# EAGLE design NU-Smarticles (EAGLE 9.3.0)

## Sheet 1 of 2
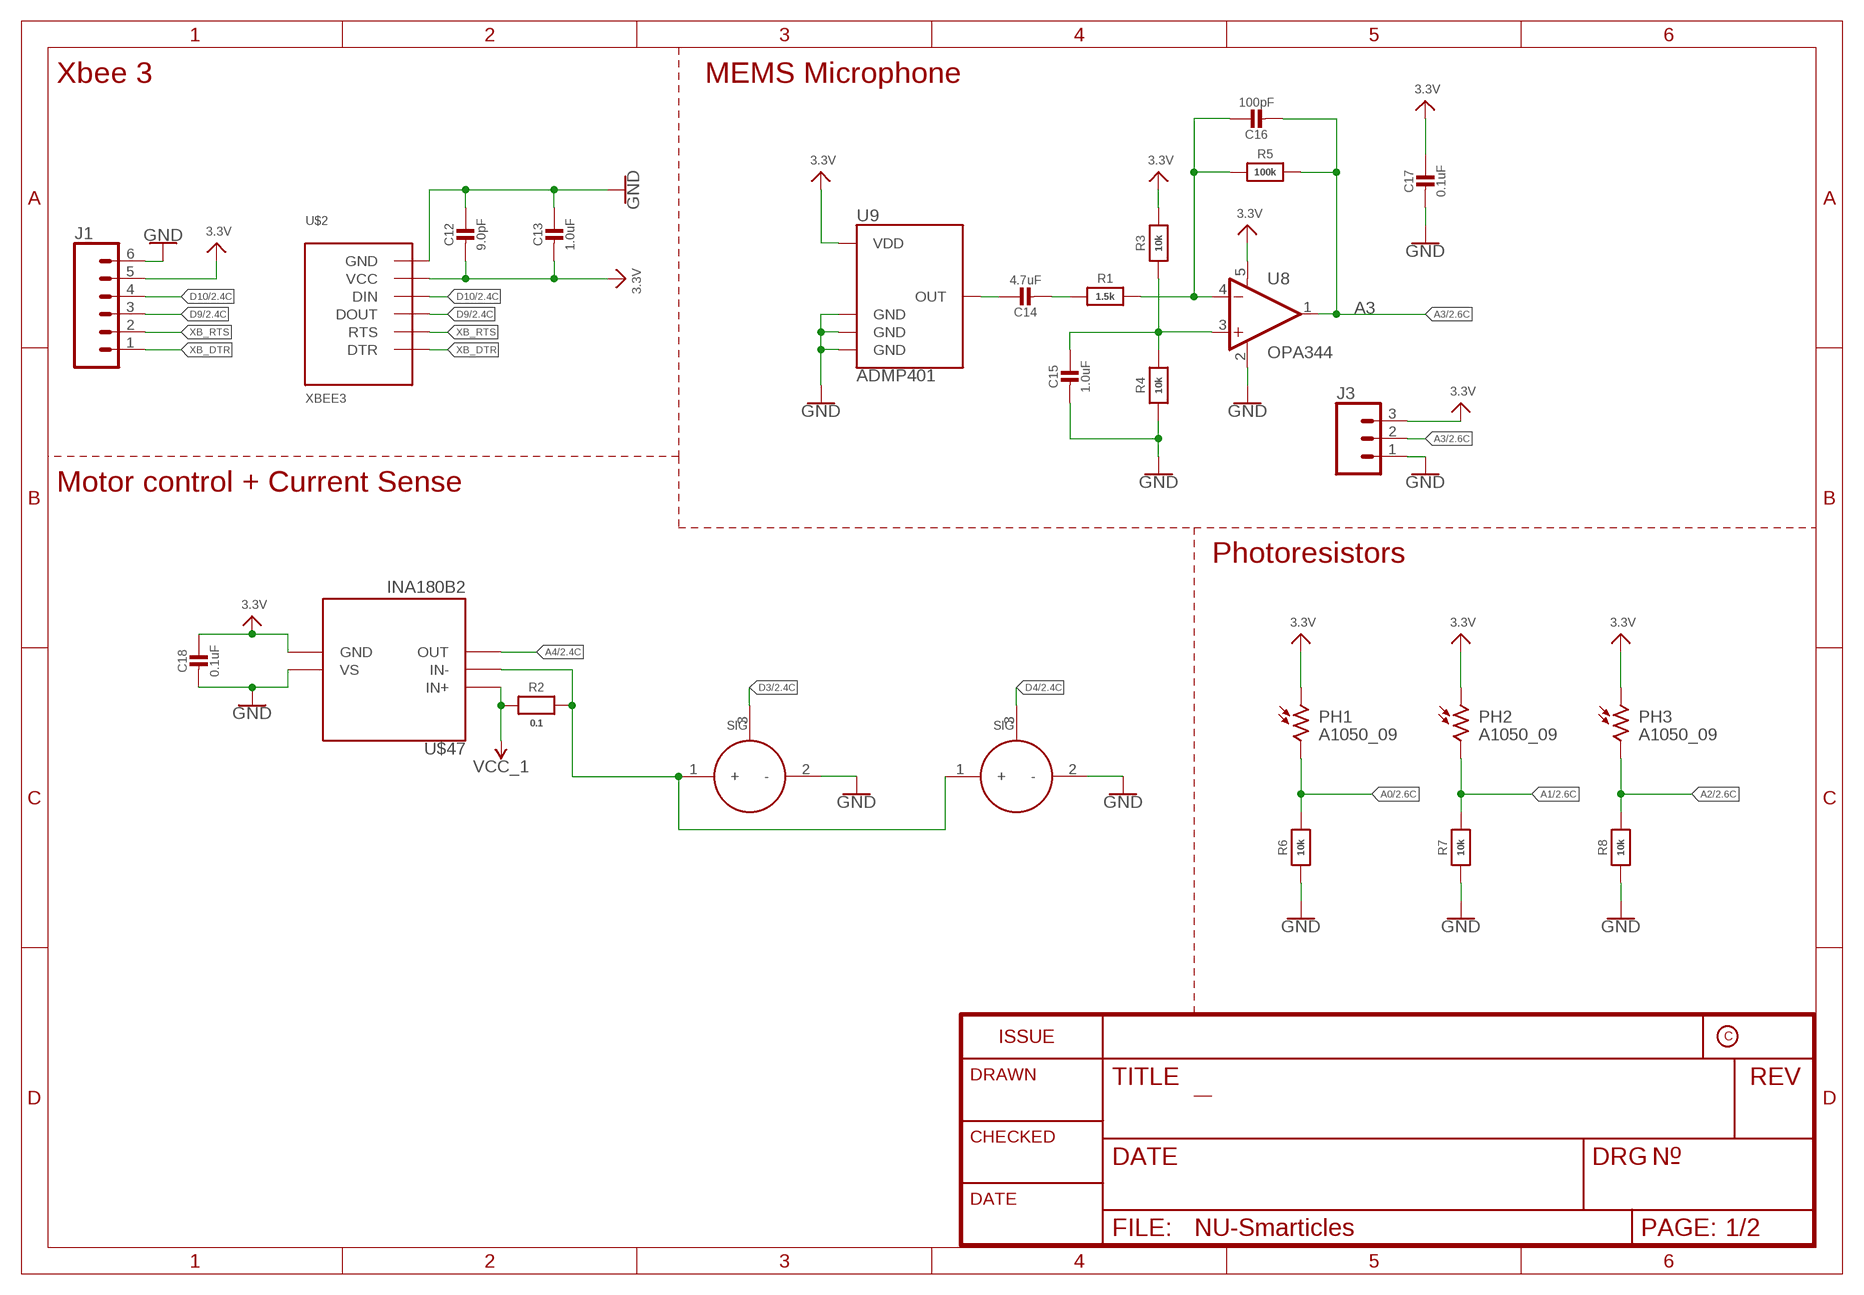
[diagram p0: schematic, sheet 1]

### Parts
C12  9.0pF  CAP_CERAMIC_0402MP  [_0402MP]
C13  1.0uF  CAP_CERAMIC_0402MP  [_0402MP]
C14  4.7uF  CAP_CERAMIC_0402MP  [_0402MP]
C15  1.0uF  CAP_CERAMIC_0402MP  [_0402MP]
C16  100pF  CAP_CERAMIC_0402MP  [_0402MP]
C17  0.1uF  CAP_CERAMIC_0402MP  [_0402MP]
C18  0.1uF  CAP_CERAMIC_0402MP  [_0402MP]
J1  CONN_06NO_SILK_FEMALE_PTH  [1X06_NO_SILK]
J3  CONN_03  [1X03]
PH1  A1050_09  [T0-46-A10XX]
PH2  A1050_09  [T0-46-A10XX]
PH3  A1050_09  [T0-46-A10XX]
R1  1.5k  RESISTOR_0402MP  [_0402MP]
R2  0.1  RESISTOR_0603MP  [_0603MP]
R3  10k  RESISTOR_0402MP  [_0402MP]
R4  10k  RESISTOR_0402MP  [_0402MP]
R5  100k  RESISTOR_0402MP  [_0402MP]
R6  10k  RESISTOR_0402MP  [_0402MP]
R7  10k  RESISTOR_0402MP  [_0402MP]
R8  10k  RESISTOR_0402MP  [_0402MP]
U8  OPA344  [SOT23-5]
U9  ADMP401  [ADMP401]
U$1  SERVO  [1X03_SERVO]
U$2  XBEE3  [XBEE3_MICRO]
U$46  SERVO  [1X03_SERVO]
U$47  INA180B2  [SOT23-5]

### Nets
3.3V: C12.2 C13.2 C17.1 C18.1 J1.5 J3.3 PH1.1 PH2.1 PH3.1 R3.2 U8.5(V+) U9.5(VDD) U$2.VCC U$47.2(GND) ; also sheet 2
A0: PH1.2 R6.2 ; also sheet 2
A1: PH2.2 R7.2 ; also sheet 2
A2: PH3.2 R8.2 ; also sheet 2
A3: C16.2 J3.2 R5.2 U8.1(OUT) ; also sheet 2
A4: U$47.4(OUT) ; also sheet 2
D3: U$1.3(SIG) ; also sheet 2
D4: U$46.3(SIG) ; also sheet 2
D9: J1.3 U$2.DOUT/DIO13(DOUT) ; also sheet 2
D10: J1.4 U$2.DIN/CONFIG/DIO14(DIN) ; also sheet 2
GND: C12.1 C13.1 C15.2 C17.2 C18.2 J1.6 J3.1 R4.1 R6.1 R7.1 R8.1 U8.2(V-) U9.2(GND) U9.4(GND) U9.6(GND) U$1.2(-) U$2.GND1(GND) U$46.2(-) U$47.5(VS) ; also sheet 2
N$1: R2.2 U$1.1(+) U$46.1(+) U$47.3(IN-)
N$16: C14.1 U9.1(OUT)
N$17: C16.1 R1.2 R5.1 U8.4(-IN)
N$29: C14.2 R1.1
N$30: C15.1 R3.1 R4.2 U8.3(+IN)
VCC_1: R2.1 U$47.1(IN+) ; also sheet 2
XB_DTR: J1.1 U$2.DTR/SLEEP_RQ/DIO8(DTR)
XB_RTS: J1.2 U$2.RTS/DIO6(RTS)

### Notes on the sheet
- Xbee 3 | MEMS Microphone
- Motor control + Current Sense
- Photoresistors

## Sheet 2 of 2
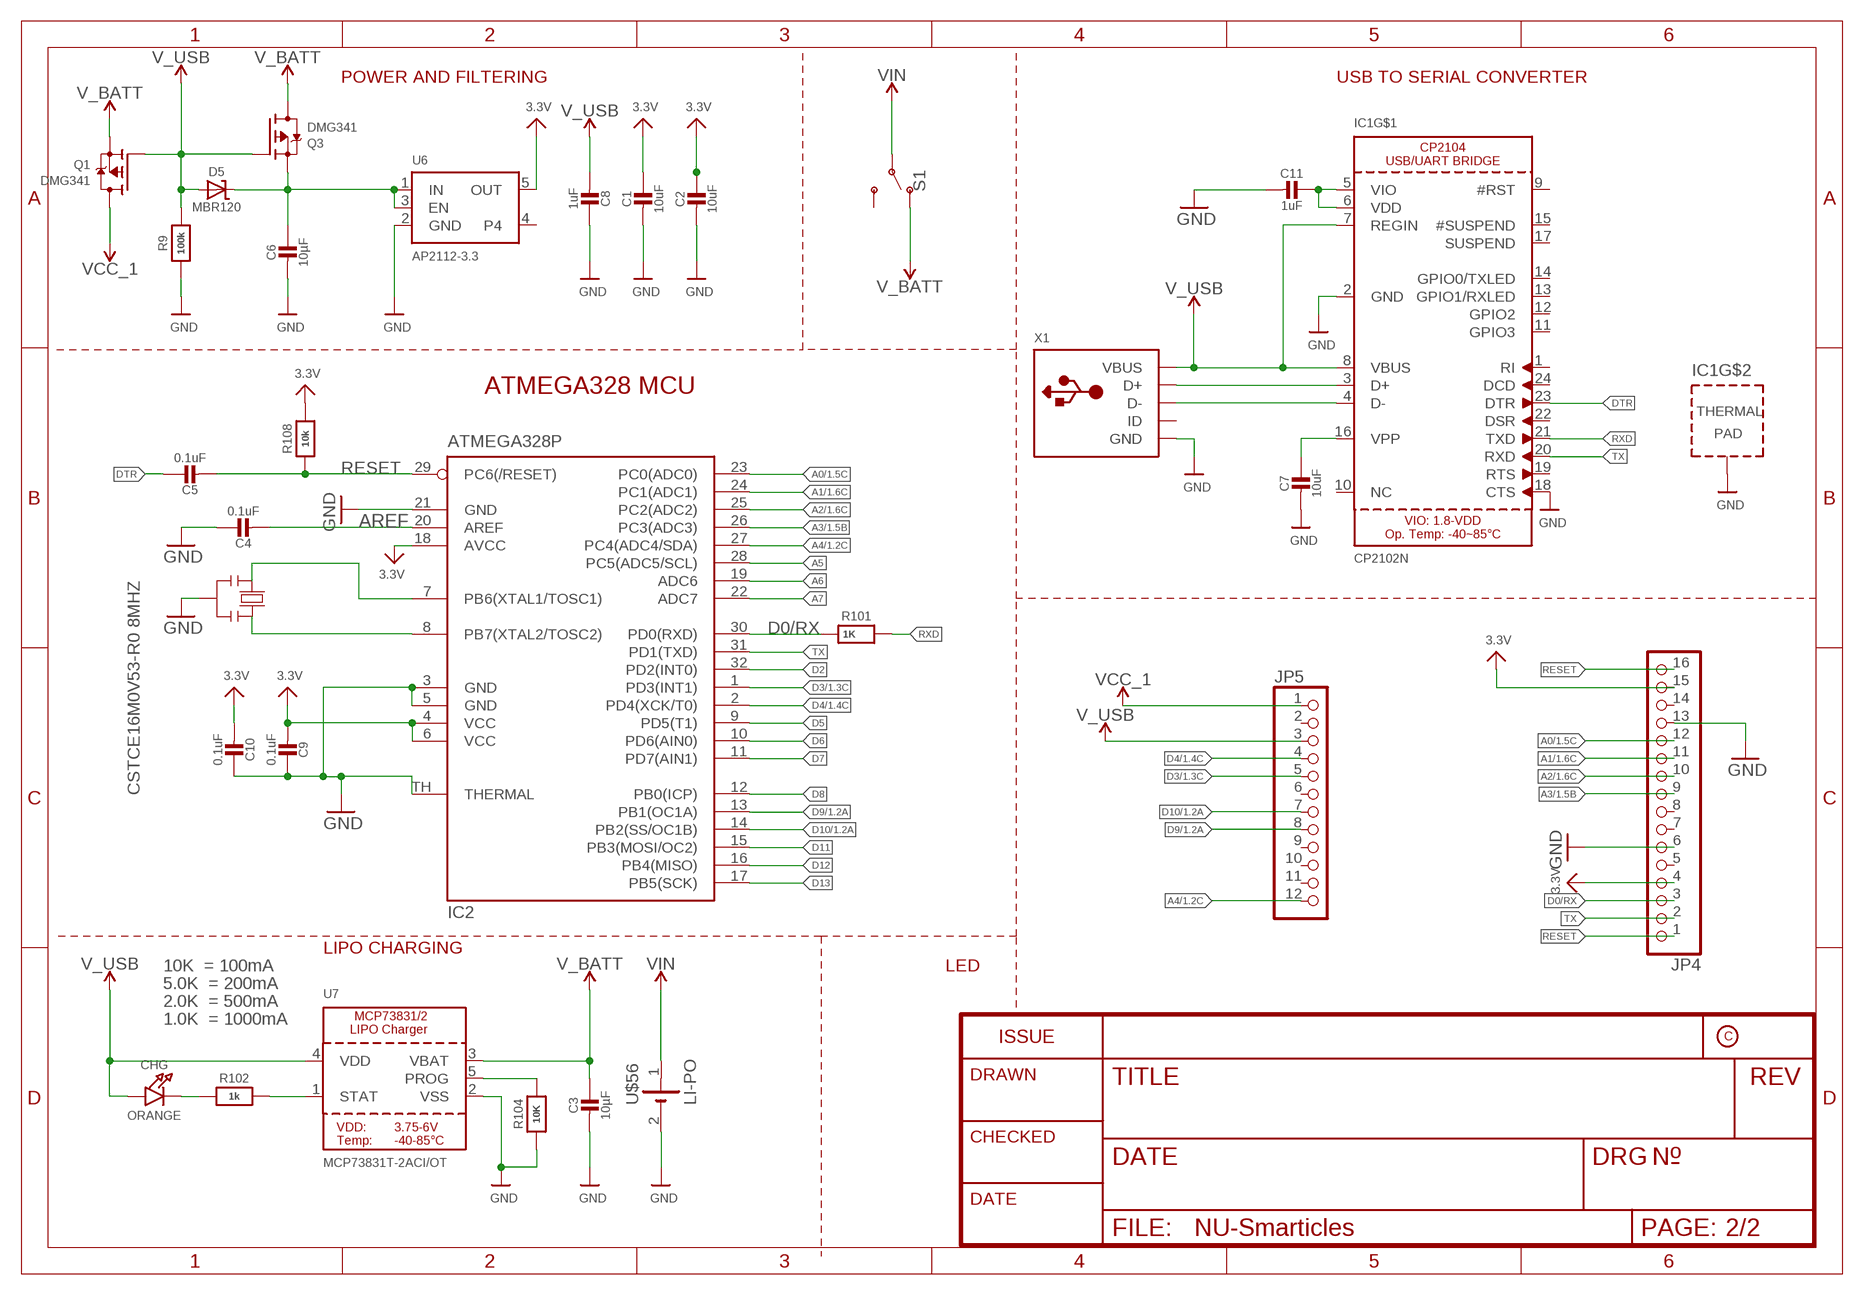
[diagram p1: schematic, sheet 2]

### Parts
C1  10uF  CAP_CERAMIC_0402MP  [_0402MP]
C2  10uF  CAP_CERAMIC_0402MP  [_0402MP]
C3  10µF  CAP_CERAMIC_0402MP  [_0402MP]
C4  0.1uF  CAP_CERAMIC_0402MP  [_0402MP]
C5  0.1uF  CAP_CERAMIC_0402MP  [_0402MP]
C6  10µF  CAP_CERAMIC_0402MP  [_0402MP]
C7  10uF  CAP_CERAMIC_0402MP  [_0402MP]
C8  1uF  CAP_CERAMIC_0402MP  [_0402MP]
C9  0.1uF  CAP_CERAMIC_0402MP  [_0402MP]
C10  0.1uF  CAP_CERAMIC_0402MP  [_0402MP]
C11  1uF  CAP_CERAMIC_0402MP  [_0402MP]
CHG  ORANGE  LED0603  [CHIPLED_0603]
D5  MBR120  DIODE-SCHOTTKYSOD-523  [SOD-523]
IC1  CP2102N  CP2104  [QFN24_4MM_SMSC]
IC2  ATMEGA328P  MEGA8-MI  [MLF32-TH]
JP4  HEADER-1X16ROUND  [1X16_ROUND]
JP5  HEADER-1X12  [1X12_ROUND]
Q1  DMG341  MOSFET-P  [SOT23-R]
Q3  DMG341  MOSFET-P  [SOT23-R]
R9  100k  RESISTOR_0402MP  [_0402MP]
R101  1K  RESISTOR_0402MP  [_0402MP]
R102  1k  RESISTOR_0402MP  [_0402MP]
R104  10K  RESISTOR_0402MP  [_0402MP]
R108  10k  RESISTOR_0402MP  [_0402MP]
S1  SWITCH-SPDT-SMD-AYZ0202  [SWITCH_DPDT_SMD_AYZ0202]
U6  AP2112-3.3  VREG_SOT23-5  [SOT23-5]
U7  MCP73831T-2ACI/OT  MCP73831/2  [SOT23-5]
U$56  LI-PO  [1X02_BATT]
X1  USBMICRO_20329  [4UCONN_20329]
Y2  CSTCE16M0V53-R0 8MHZ  RESONATORMU  [RESONATOR]

### Nets
3.3V: C1.1 C2.1 C9.2 C10.2 IC2.4(VCC) IC2.6(VCC) IC2.18(AVCC) JP4.4 JP4.15 R108.2 U6.5(OUT) ; also sheet 1
A0: IC2.23(PC0(ADC0)) JP4.12 ; also sheet 1
A1: IC2.24(PC1(ADC1)) JP4.11 ; also sheet 1
A2: IC2.25(PC2(ADC2)) JP4.10 ; also sheet 1
A3: IC2.26(PC3(ADC3)) JP4.9 ; also sheet 1
A4: IC2.27(PC4(ADC4/SDA)) JP5.12 ; also sheet 1
A5: IC2.28(PC5(ADC5/SCL))
A6: IC2.19(ADC6)
A7: IC2.22(ADC7)
AREF: C4.2 IC2.20(AREF)
D0/RX: IC2.30(PD0(RXD)) JP4.3 R101.1
D2: IC2.32(PD2(INT0))
D3: IC2.1(PD3(INT1)) JP5.5 ; also sheet 1
D4: IC2.2(PD4(XCK/T0)) JP5.4 ; also sheet 1
D5: IC2.9(PD5(T1))
D6: IC2.10(PD6(AIN0))
D7: IC2.11(PD7(AIN1))
D8: IC2.12(PB0(ICP))
D9: IC2.13(PB1(OC1A)) JP5.8 ; also sheet 1
D10: IC2.14(PB2(SS/OC1B)) JP5.7 ; also sheet 1
D11: IC2.15(PB3(MOSI/OC2))
D12: IC2.16(PB4(MISO))
D13: IC2.17(PB5(SCK))
DTR: C5.1 IC1.23(DTR)
GND: C1.2 C2.2 C3.2 C4.1 C6.2 C7.2 C8.1 C9.1 C10.1 C11.2 IC1.2(GND) IC1.18(CTS) IC1.THERM(TP) IC2.3(GND) IC2.5(GND) IC2.21(GND) IC2.TH(THERMAL) JP4.6 JP4.13 R9.1 R104.1 U6.2(GND) U7.2(VSS) U$56.2(-) X1.BASE@1(GND) X1.BASE@2(GND) X1.GND X1.SPRT@1(GND) X1.SPRT@2(GND) X1.SPRT@3(GND) X1.SPRT@4(GND) Y2.2 ; also sheet 1
N$2: IC1.3(D+) X1.D+
N$3: IC1.4(D-) X1.D-
N$18: CHG.C R102.1
N$19: R102.2 U7.1(STAT)
N$20: R104.2 U7.5(PROG)
N$23: C6.1 D5.K(C) Q3.2(S) U6.1(IN) U6.3(EN)
N$27: C11.1 IC1.5(VIO) IC1.6(VDD)
N$41: C7.1 IC1.16(VPP)
RESET: C5.2 IC2.29(PC6(/RESET)) JP4.1 JP4.16 R108.1
RXD: IC1.21(TXD) R101.2
TX: IC1.20(RXD) IC2.31(PD1(TXD)) JP4.2
V_BATT: C3.1 Q1.2(S) Q3.3(D) S1.1(O) U7.3(VBAT)
V_USB: C8.2 CHG.A D5.A IC1.7(REGIN) IC1.8(VBUS) JP5.3 Q1.1(G) Q3.1(G) R9.2 U7.4(VDD) X1.VBUS
VCC_1: JP5.1 Q1.3(D) ; also sheet 1
VIN: S1.2(P) U$56.1(+)
XTAL1: IC2.8(PB7(XTAL2/TOSC2)) Y2.3
XTAL2: IC2.7(PB6(XTAL1/TOSC1)) Y2.1
Unconnected: IC1.1(RI) IC1.9(#RST) IC1.10(NC) IC1.11(GPIO3) IC1.12(GPIO2) IC1.13(GPIO1/RXLED) IC1.14(GPIO0/TXLED) IC1.15(#SUSPEND) IC1.17(SUSPEND) IC1.19(RTS) IC1.22(DSR) IC1.24(DCD) JP4.5 JP4.7 JP4.8 JP4.14 JP5.2 JP5.6 JP5.9 JP5.10 JP5.11 S1.3(S) U6.4 X1.ID

### Notes on the sheet
- POWER AND FILTERING | USB TO SERIAL CONVERTER
- ATMEGA328 MCU
- LIPO CHARGING
- 10K  = 100mA | LED
- 5.0K  = 200mA
- 2.0K  = 500mA
- 1.0K  = 1000mA

## Library data of the parts
C1 C2 C4-C18 = NU-Smarticles:CAP_CERAMIC: Ceramic Capacitors For new designs, use the packages preceded by an '_' character since they are more reliable: The following footprints should be used on most boards: _0402 - Standard footprint for regular board layouts _0603 - Standard footprint for regular board layouts _0805 - Standard footprint for regular board layouts _1206 - Standard footprint for regular board layouts For extremely tight-pitch boards where space is at a premium, the following 'micro-pitch' footprints can be used (smaller pads, no silkscreen outline, etc.): _0402MP - Micro-pitch footprint for very dense/compact boards _0603MP - Micro-pitch footprint for very dense/compact boards _0805MP - Micro-pitch footprint for very dense/compact boards _1206MP - Micro-pitch footprint for very dense/compact boards
C3 = microbuilder:CAP_CERAMIC: Ceramic Capacitors For new designs, use the packages preceded by an '_' character since they are more reliable: The following footprints should be used on most boards: _0402 - Standard footprint for regular board layouts _0603 - Standard footprint for regular board layouts _0805 - Standard footprint for regular board layouts _1206 - Standard footprint for regular board layouts For extremely tight-pitch boards where space is at a premium, the following 'micro-pitch' footprints can be used (smaller pads, no silkscreen outline, etc.): _0402MP - Micro-pitch footprint for very dense/compact boards _0603MP - Micro-pitch footprint for very dense/compact boards _0805MP - Micro-pitch footprint for very dense/compact boards _1206MP - Micro-pitch footprint for very dense/compact boards
CHG = microbuilder:LED: LED 0603 - 0603 Surface Mount Package 2mA: Green LED - Low Power (3.9mcd, 2ma, 1.7Vf) - Digikey: 475-2709-2-ND Orange LED - Low Power (9.8mcd, 2ma, 1.8Vf) - Digikey: 475-1194-2-ND Red LED - Low Power (5mcd, 2ma, 1.8Vf) - Digikey: 475-1195-2-ND Yellow LED - Low Power (7mcd, 2ma, 1.8Vf) - Digikey: 475-1196-2-ND 5mA: Blue LED - Low Power (17mcd, 5ma, 2.9Vf) - Digikey: LNJ937W8CRACT-ND 0805 - 0805 Surface Mount Package 2mA: Red LED (8.8mcd, 2mA, 1.8Vf, Clear) - Low Power [Digikey: 475-2510-1-ND] Green LED (5mcd, 2mA, 1.8Vf, Clear) - Low Power [Digikey: 475-2730-1-ND] Yellow LED (11.3mcd, 2mA, 1.8Vf, Clear) - Low Power [Digikey: 475-2555-1-ND] 20mA: Red LED (104mcd, 20mA, Diffused) - LS R976 [Digikey: 475-1278-6-ND] Red LED (12mcd, 20mA, 2.0Vf, Clear) - APT2012EC [Digikey: 754-1128-1-ND] Green LED (15mcd, 20mA, 2.2Vf, Clear) - APT2012GC [Digikey: 754-1131-1-ND] Orange LED (160mcd, 20mA, 2.1Vf, Clear) - APT2012SECK [Digikey: 754-1130-1-ND] 1206 - 1206 Surface Mount Package Green LED (26mcd, 20mA, Diffused) - LG N971 [Digikey: 475-1407-6-ND] Red LED (15mcd, 20mA, Diffused) - LH N974 [Digikey: 475-1416-6-ND] Cree - Cree High-Power Surface Mount LEDs XPEBWT-L1-0000-00D50 - White 111lm 350mA 2.9Vf 6200K 110° XTEAWT-00-0000-00000LEE3 - White 114lm 350mA 2.85Vf 5000K 115° Everlight - Everlight 45-21 Series Surface Mount LEDs 45-21/QK2C-B2832AC2CB2/2T - Warm White 2000mcd 20mA 3.25Vf 3050K 120° 45-21/LK2C-B38452C4CB2/2T - Nuetral White 2000mcd 20mA 3.25Vf 4150K 120° 45-21/LK2C-B50634C6CB2/2T - Cold White 2200mcd 20mA 3.25Vf 5650K 120° PLCC2 Reverse Mount LS T77K-J1L2-1-0-2-R18-Z - Red 11.25mcd 2mA 1.8Vf 630nm 120° LO T77K-L1M2-24-Z - Orange 19.6mcd 2mA 1.8Vf 606nm 120° LY T77K-K2M1-26-Z - Yellow 15.7mcd 2mA 1.8Vf 587nm 120°
D5 = microbuilder:DIODE-SCHOTTKY
IC1 = microbuilder:CP2104: CP2104 - USB to UART Bridge VDD Output: 3.45V
IC2 = microbuilder:MEGA8-MI: MICROCONTROLLER 8 Kbytes FLASH, 1 kbytes SRAM, 512 bytes EEPROM, USART, 6-channel 10 bit ADC, 2-channel 8 bit ADC Pin compatible with Atmega48, ATMega88, ATMega168 Source: avr.lbr; MPN: ATMEGA88PA-MU; OC_FARNELL: 1715491; OC_NEWARK: 15R0272
J1 = SparkFun-Connectors:CONN_06: Multi connection point. Often used as Generic Header-pin footprint for 0.1 inch spaced/style header connections On any of the 0.1 inch spaced packages, you can populate with these: Break Away Headers - Straight <https://www.sparkfun.com/products/116> (PRT-00116) Break Away Male Headers - Right Angle <https://www.sparkfun.com/products/553> (PRT-00553) Female Headers <https://www.sparkfun.com/products/115> (PRT-00115) Break Away Headers - Machine Pin <https://www.sparkfun.com/products/117> (PRT-00117) Break Away Female Headers - Swiss Machine Pin <https://www.sparkfun.com/products/743> (PRT-00743) Arduino Stackable Header - 6 Pin <https://www.sparkfun.com/products/9280> (PRT-09280) For SCREWTERMINALS and SPRING TERMINALS visit here: Screw Terimnals on SparkFun.com <https://www.sparkfun.com/search/results?term=Screw+Terminals> (5mm/3.5mm/2.54mm spacing) This device is also useful as a general connection point to wire up your design to another part of your project. Our various solder wires solder well into these plated through hole pads. Hook-Up Wire - Assortment (Stranded, 22 AWG) <https://www.sparkfun.com/products/11375> (PRT-11375) Hook-Up Wire - Assortment (Solid Core, 22 AWG) <https://www.sparkfun.com/products/11367> (PRT-11367) View the entire wire category on our website here <https://www.sparkfun.com/categories/141>; PROD_ID: CONN-08437
J3 = SparkFun-Connectors:CONN_03: Multi connection point. Often used as Generic Header-pin footprint for 0.1 inch spaced/style header connections On any of the 0.1 inch spaced packages, you can populate with these: Break Away Headers - Straight <https://www.sparkfun.com/products/116> (PRT-00116) Break Away Male Headers - Right Angle <https://www.sparkfun.com/products/553> (PRT-00553) Female Headers <https://www.sparkfun.com/products/115> (PRT-00115) Break Away Headers - Machine Pin <https://www.sparkfun.com/products/117> (PRT-00117) Break Away Female Headers - Swiss Machine Pin <https://www.sparkfun.com/products/743> (PRT-00743) Stackable Header - 3 Pin (Female, 0.1") <https://www.sparkfun.com/products/13875> (PRT-13875) For SCREWTERMINALS and SPRING TERMINALS visit here: Screw Terimnals on SparkFun.com <https://www.sparkfun.com/search/results?term=Screw+Terminals> (5mm/3.5mm/2.54mm spacing) This device is also useful as a general connection point to wire up your design to another part of your project. Our various solder wires solder well into these plated through hole pads. Hook-Up Wire - Assortment (Stranded, 22 AWG) <https://www.sparkfun.com/products/11375> (PRT-11375) Hook-Up Wire - Assortment (Solid Core, 22 AWG) <https://www.sparkfun.com/products/11367> (PRT-11367) View the entire wire category on our website here <https://www.sparkfun.com/categories/141> Special notes: Molex polarized connector foot print use with SKU : PRT-08232 with associated crimp pins and housings.
JP4 = microbuilder:HEADER-1X16: PIN HEADER
JP5 = microbuilder:HEADER-1X12
PH1-PH3 = NU-Smarticles:A10: Sensor Robust Light Sensing Applications Outdoor Light Sensing Application Source: http://optoelectronics.perkinelmer.com/content/Datasheets/DTS_PhotocellsA1050.pdf
Q1 Q3 = microbuilder:MOSFET-P: P-Channel Mosfet LEGEND VDS: Voltage Drain-Source ID: Drain Current RDS(ON): Drain-Source On-State Resistance VGS(TH): Gate-Source Threshold Voltage CISS: Drain-Source Input Capacitance SOT-23 Name VDS ID RDS(ON) VGS(TH) CISS Order Number IRLML5103 30V 760mA 600 mOhm -- 75pF @ 25V Digikey: IRLML5103PBFCT-ND IRLML6401 12V 4.3A 50 mOhm 950mV @ 250µA 830pF @ 10V Digikey: IRLML6401PBFTR-ND NTR0202PL 20V 400mA 800 mOhm 2.3V @ 250uA 70pF @ 5V Digikey: NTR0202PLT1GOSTR-ND NTR4101PT1G 20V 1.8A 85 mOhm 1.2V @ 250uA 675pF @ 10V Digikey: NTR4101PT1GOSCT-ND DMP2004K 20V 600mA 900 mOhm 1V @ 250uA 175pF @ 16V Digikey: DMP2004KDICT-ND PMV65XP 20V 3.9A 76 mOhm 950mV @ 1mA 725pF @ 20V Digikey: 568-2358-2-ND TO-252 Name VDS ID RDS(ON) VGS(TH) CISS Order Number AOD417 30V 25A 34 mOhm 3V @ 250µA 920pF @ 15V Digikey: 785-1106-2-ND PowerPak Name VDS ID RDS(ON) VGS(TH) CISS Order Number AON7401 30V 12A 14 mOhm 3V @ 250µA 2600pF @ 15V Digikey: 785-1302-1-ND
R1-R9 R102 R108 = NU-Smarticles:RESISTOR: Resistors For new designs, use the packages preceded by an '_' character since they are more reliable: The following footprints should be used on most boards: _0402 - Standard footprint for regular board layouts _0603 - Standard footprint for regular board layouts _0805 - Standard footprint for regular board layouts _1206 - Standard footprint for regular board layouts For extremely tight-pitch boards where space is at a premium, the following 'micro-pitch' footprints can be used (smaller pads, no silkscreen outline, etc.): _0402MP - Micro-pitch footprint for very dense/compact boards _0603MP - Micro-pitch footprint for very dense/compact boards _0805MP - Micro-pitch footprint for very dense/compact boards _1206MP - Micro-pitch footprint for very dense/compact boards
R101 R104 = microbuilder:RESISTOR: Resistors For new designs, use the packages preceded by an '_' character since they are more reliable: The following footprints should be used on most boards: _0402 - Standard footprint for regular board layouts _0603 - Standard footprint for regular board layouts _0805 - Standard footprint for regular board layouts _1206 - Standard footprint for regular board layouts For extremely tight-pitch boards where space is at a premium, the following 'micro-pitch' footprints can be used (smaller pads, no silkscreen outline, etc.): _0402MP - Micro-pitch footprint for very dense/compact boards _0603MP - Micro-pitch footprint for very dense/compact boards _0805MP - Micro-pitch footprint for very dense/compact boards _1206MP - Micro-pitch footprint for very dense/compact boards
S1 = NU-Smarticles:SWITCH-SPDT: Single Pole, Double Throw (SPDT) Switch Single-pole, double-throw (SPDT) switch. Variant Overview SMD-AYZ0202 Surface Mount DPDT Switch <https://www.sparkfun.com/products/597> (COM-00597) Used on e.g. LilyPad Arduino USB - ATmega32U4 Board <https://www.sparkfun.com/products/12049> PTH-11.6X4.0MM SPDT Mini Power Switch <https://www.sparkfun.com/products/102> (COM-00102) Used on e.g. SparkFun Simon Says - Through-Hole Soldering Kit <https://www.sparkfun.com/products/10547> (KIT-10547) PTH-11.6X4.0MM-KIT KIT version of SPDT Mini Power Switch - Simplifies soldering by removing tStop of switch pins - only one side can be soldered. PTH-11.6X4.0MM-LOCK LOCK version of SPDT Mini Power Switch - Offset pins hold switch in place for easier soldering. SMD-RIGHT-ANGLE Surface Mount Right Angle Switch <https://www.sparkfun.com/products/10860> (COM-10860) Used on e.g. SparkFun ESP8266 Thing <https://www.sparkfun.com/products/13231>; PROD_ID: SWCH-08179; SF_ID: COM-00597
U6 = NU-Smarticles:VREG_SOT23-5: SOT23-5 Fixed Voltage Regulators Part Current Out V Out V In V Dropout θJA (°C/W) TJ (°C) Digikey Part No. ADP121 150mA 3.3V 3.4-5.5V 0.09V @ 150mA -- -- ADP121-AUJZ33R7CT-ND ADP121 150mA 3.0V 3.1-5.5V 0.09V @ 150mA -- -- ADP121-AUJZ30R7CT-ND ADP122 300mA 3.3V 3.4-5.5V 0.085V @ 300mA -- -- ADP122AUJZ-3.3-R7CT-ND ADP1712 300mA 3.3V 3.5-5.5V 0.17V @ 300mA -- -- ADP1712AUJZ-3.3-R7TR-ND AP7311 (Low Cost) 150mA 3.3V 3.5-6V 0.15V @ 150mA -- -- AP7311-33WG-7DICT-ND LD39015M18R 150mA 1.8V 1.9V-5.5V 0.08V @ 100mA -- -- 497-6977-1-ND LP2985A-33DBVR 150mA 3.3V 3.3-16V 0.28V @ 150mA 206 150 296-18479-1-ND MCP1824T-3302E/OT 300mA 3.3V 3.5V-6V 0.2V @ 300mA -- -- MCP1824T-3302E/OTCT-ND MIC5205-2.5YM5 TR 150mA 2.5V 2.7-16V 0.165V @ 150mA -- -- 576-1257-2-ND MIC5205-3.0YM5 TR 150mA 3.0V 3.2V-16V 0.165V @ 150mA -- -- 576-1258-2-ND MIC5205-3.3YM5 TR 150mA 3.3V 3.5V-16V 0.165V @ 150mA -- -- 576-1259-2-ND TPS780330220 150mA 3.3V+2.2V 3.6-5.5V 250mV Max -- -- 296-23332-1-ND TDA3663/N1,135 100mA 3.3V 3.5-45V 0.18V @ 50mA -- -- 568-5343-1-ND Max operating temp can be calculated using θJA, TJ (max junction temperature), and power in watts. Set the "Maximum Ambient Temperature" until it reaches TJ ("Max Junction Temperature"), which is the absolute limit for safe use of the regulator: Heat Sink Temperature Calculator <http://www.daycounter.com/Calculators/Heat-Sink-Temperature-Calculator.phtml> For example, With 12V source into a 3.3V LP2985 and a 30mA load, we are dissipating (12V-3.3V) * 0.03A = 0.261W. With a θJA of 206 °C/W, a TJ of 150°C, and 261mW we can safely use the chip without a heat sink up to 75°C (=147.1°C Junction Temperature).
U7 = microbuilder:MCP73831/2: MCP73831/2 LIPO Charger VDD: 3.75 - 6V Temp -40 - 85°C Programmable Charge Rate: 15-500mA NOTE: STAT is a tri-state logic output on the MCP73831 and an open-drain output on the MCP73832. SOT23-5 with 4.2V output and tri-state logic on STAT = MCP73831T-2ACI/OT
U8 = NU-Smarticles:OPA344
U9 = NU-Smarticles:ADMP401: MEMS Microphone
U$1 U$46 = NU-Smarticles:SERVO
U$2 = NU-Smarticles:XBEE3: XBee 3 802.15
U$47 = NU-Smarticles:INA180B2: 50x gain current sense amplifier
U$56 = NU-Smarticles:LI-PO: Pins connecting to LiPo Battery
X1 = Adafruit Feather 328P:USB: USB Connectors USBMINIB - Surface Mount Female Mini-B USB Connector 4UConnector: 06564
Y2 = SmartPrj:RESONATOR

## Net classes
1 vcc: width 0.254 mm
4 aref: width 0.254 mm, drill 0.483 mm, clearance 0.203 mm

## Board
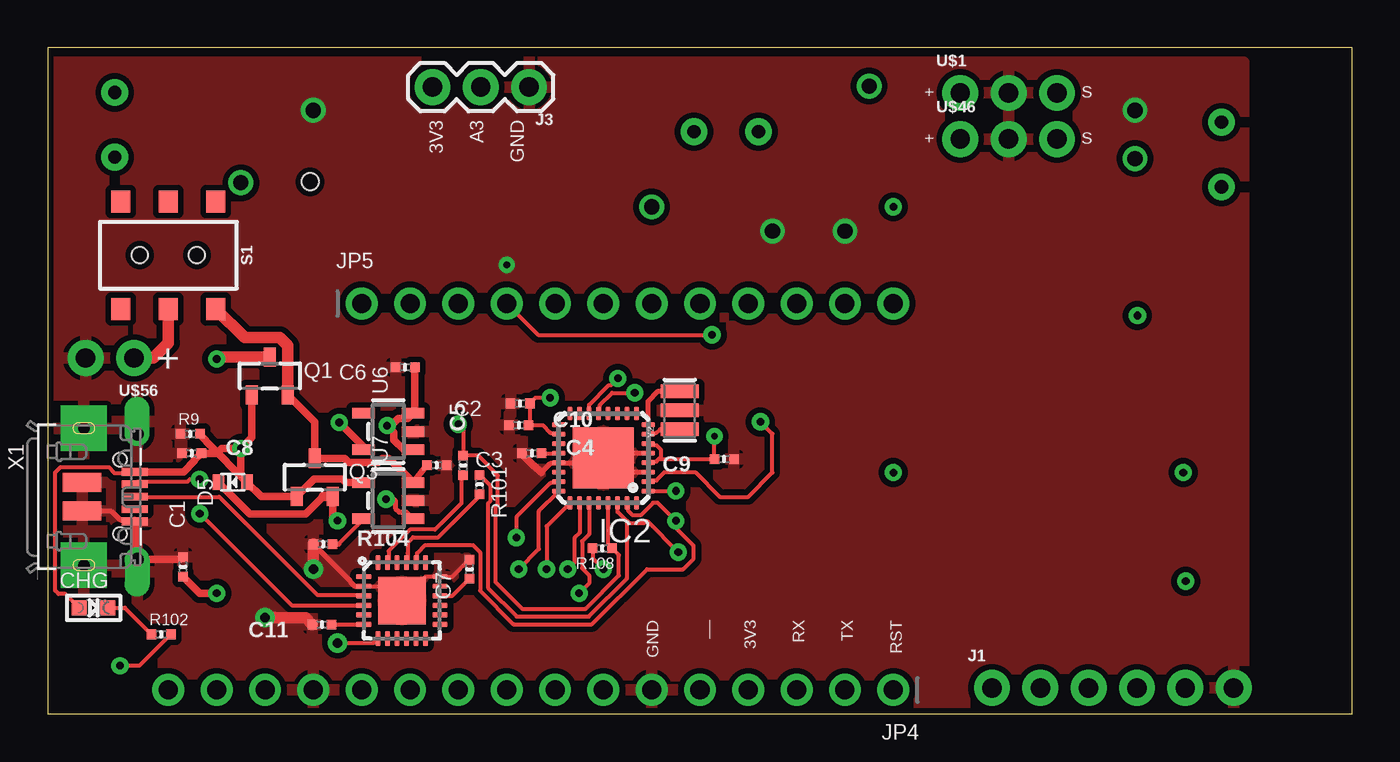
[diagram p2: board, top side]
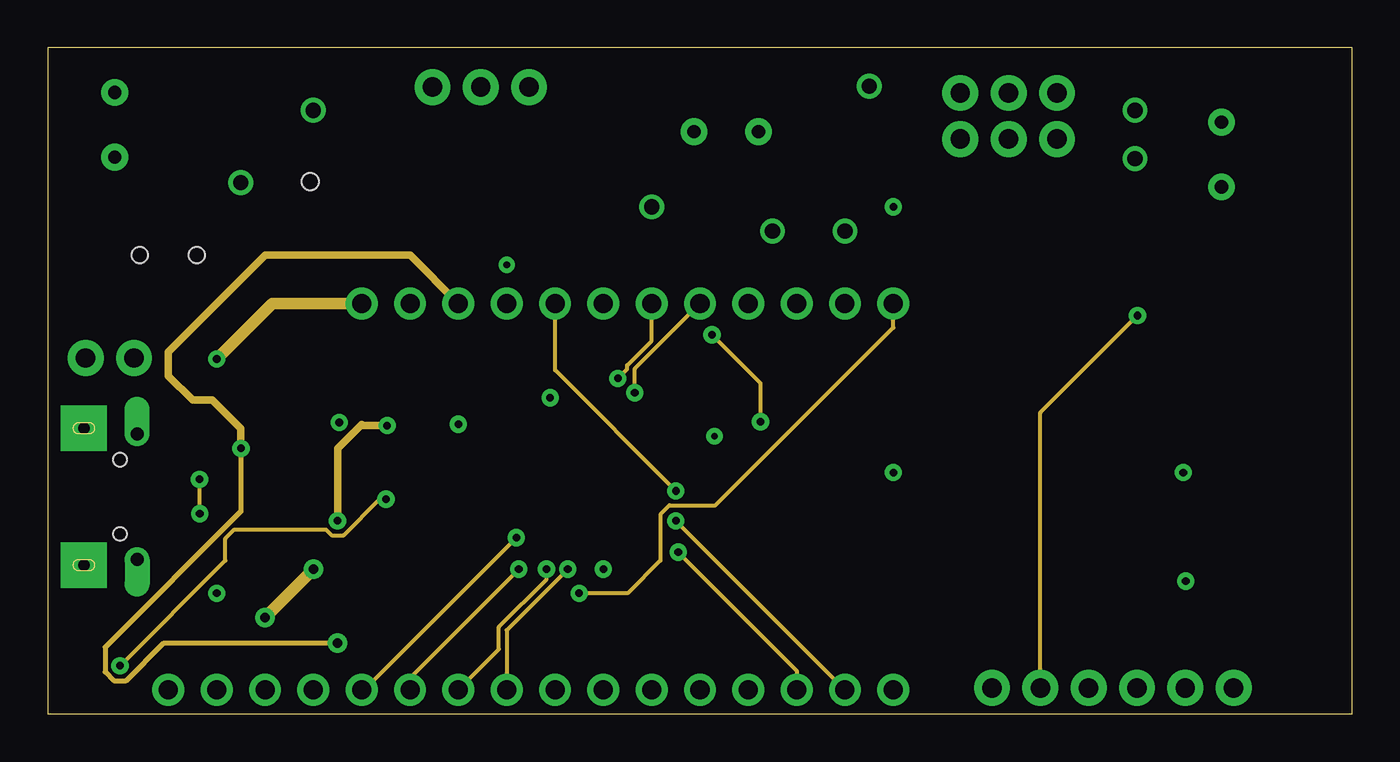
[diagram p3: board, inner layer Route2]
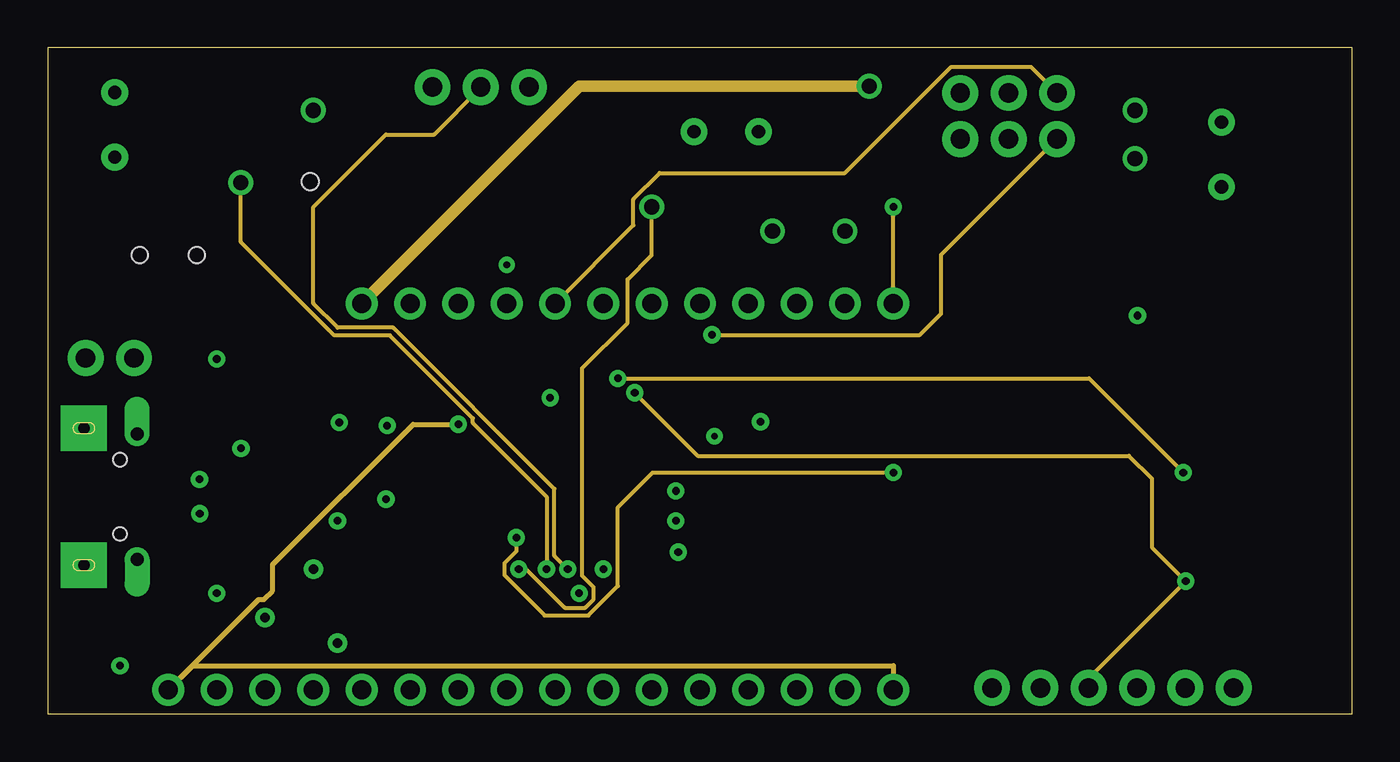
[diagram p4: board, inner layer Route15]
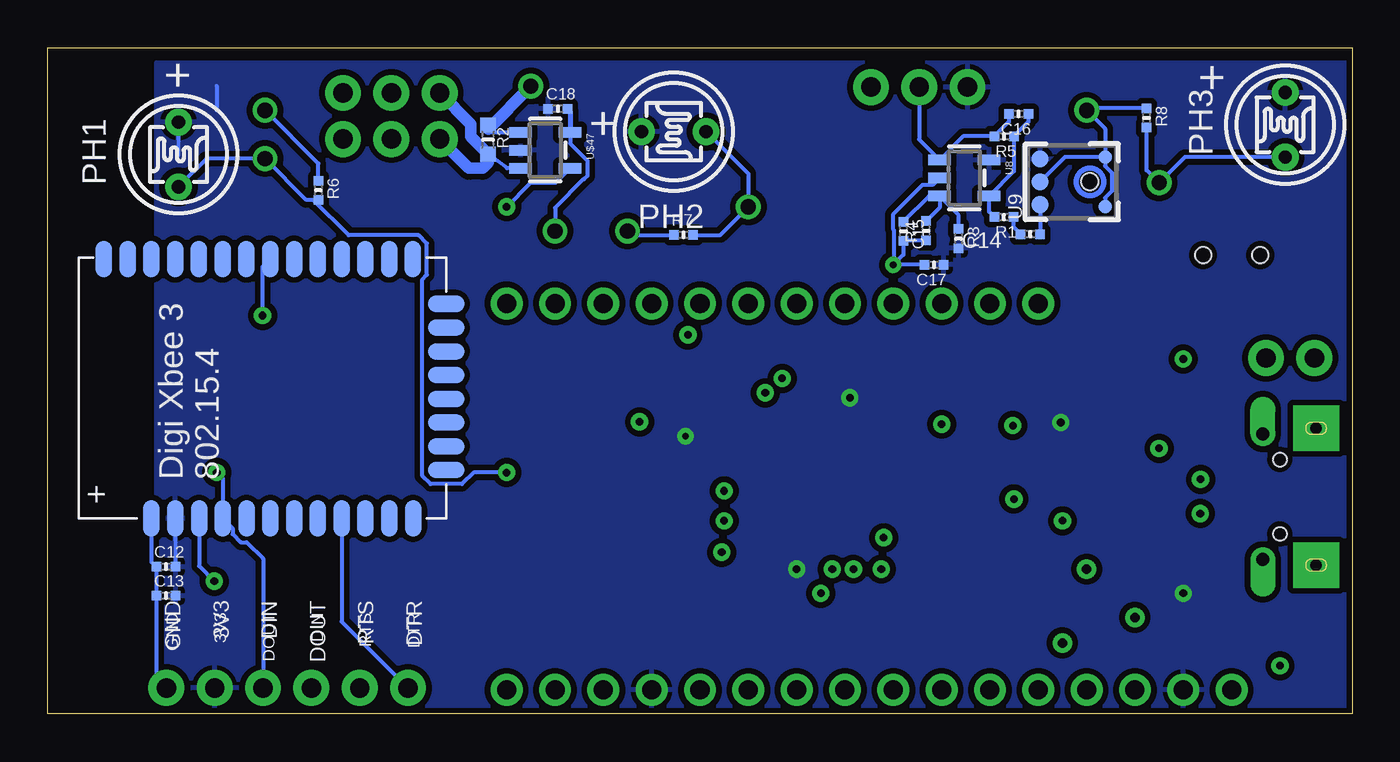
[diagram p5: board, bottom side, seen from below]

Size 68.58 x 35.05 mm. Coordinates in mm from the lower left corner, seen from the top.
Outline: 0,0 68.58,0 68.58,35.05 0,35.05 0,0
Copper layers (1+2*15+16): Top 0.035mm / dielectric 1.5mm / Route2 0.035mm / dielectric 0.15mm / Route15 0.035mm / dielectric 0.2mm / Bottom 0.035mm
Design rules "SparkFun *": minimum track width 8mil, minimum drill 0.3mm, track to track 8mil, track to pad 8mil, pad to pad 8mil, via to via 8mil, smd to smd 8mil, copper to edge 10mil, drill to drill 8mil, minimum pad ring 12mil, minimum via ring 10mil, stop-mask expansion 4mil, vias tented up to drill 25mil, thermal gap 10mil

### Footprints (pad centres in the part's own frame; a part is rotated, then mirrored left to right if it is on the bottom)
_0402MP = smd 0.5 x 0.5: 1 -0.508,0; 2 0.508,0
CHIPLED_0603 = smd 0.8 x 0.8: A 0,-0.75; C 0,0.75
SOD-523 = smd 0.8 x 0.6: A 0,-0.75; K 0,0.75
QFN24_4MM_SMSC = smd 0.8 x 0.28: 1 -2,1.25; 2 -2,0.75; 3 -2,0.25; 4 -2,-0.25; 5 -2,-0.75; 6 -2,-1.25; 13 2,-1.25; 14 2,-0.75; 15 2,-0.25; 16 2,0.25; 17 2,0.75; 18 2,1.25 | smd 0.28 x 0.8: 7 -1.25,-2; 8 -0.75,-2; 9 -0.25,-2; 10 0.25,-2; 11 0.75,-2; 12 1.25,-2; 19 1.25,2; 20 0.75,2; 21 0.25,2; 22 -0.25,2; 23 -0.75,2; 24 -1.25,2 | smd 2.5 x 2.5: THERM 0,0
MLF32-TH = smd 0.7 x 0.25: 1 -2.35,1.75; 2 -2.35,1.25; 3 -2.35,0.75; 4 -2.35,0.25; 5 -2.35,-0.25; 6 -2.35,-0.75; 7 -2.35,-1.25; 8 -2.35,-1.75; 17 2.35,-1.75; 18 2.35,-1.25; 19 2.35,-0.75; 20 2.35,-0.25; 21 2.35,0.25; 22 2.35,0.75; 23 2.35,1.25; 24 2.35,1.75 | smd 0.25 x 0.7: 9 -1.75,-2.35; 10 -1.25,-2.35; 11 -0.75,-2.35; 12 -0.25,-2.35; 13 0.25,-2.35; 14 0.75,-2.35; 15 1.25,-2.35; 16 1.75,-2.35; 25 1.75,2.35; 26 1.25,2.35; 27 0.75,2.35; 28 0.25,2.35; 29 -0.25,2.35; 30 -0.75,2.35; 31 -1.25,2.35; 32 -1.75,2.35 | smd 3.2 x 3.2: TH 0,0
1X06_NO_SILK = drill 1.016 pad 1.88: 1 0,0; 2 2.54,0; 3 5.08,0; 4 7.62,0; 5 10.16,0; 6 12.7,0
1X03 = drill 1.016 pad 1.88: 1 0,0; 2 2.54,0; 3 5.08,0
1X16_ROUND = drill 1 pad 1.676: 1 -19.05,0; 2 -16.51,0; 3 -13.97,0; 4 -11.43,0; 5 -8.89,0; 6 -6.35,0; 7 -3.81,0; 8 -1.27,0; 9 1.27,0; 10 3.81,0; 11 6.35,0; 12 8.89,0; 13 11.43,0; 14 13.97,0; 15 16.51,0; 16 19.05,0
1X12_ROUND = drill 1 pad 1.676: 1 -13.97,0; 2 -11.43,0; 3 -8.89,0; 4 -6.35,0; 5 -3.81,0; 6 -1.27,0; 7 1.27,0; 8 3.81,0; 9 6.35,0; 10 8.89,0; 11 11.43,0; 12 13.97,0
T0-46-A10XX = drill 0.7 pad 1.4: 1 -1.7,0; 2 1.7,0
SOT23-R = smd 0.635 x 1.016: 1 -0.95,-1; 2 0.95,-1; 3 0,1
_0603MP = smd 0.8 x 0.8: 1 -0.762,0; 2 0.762,0
SWITCH_DPDT_SMD_AYZ0202 = smd 1 x 1.15: 1 -2.5,2.825; 2 0,2.825; 3 2.5,2.825; 4 -2.5,-2.825; 5 0,-2.825; 6 2.5,-2.825 | hole 0.85: 1.5,0; -1.5,0
SOT23-5 = smd 0.55 x 1.2: 1 -0.95,-1.3; 2 0,-1.3; 3 0.95,-1.3; 4 0.95,1.3; 5 -0.95,1.3
ADMP401 = smd 0.9 x 0.9: 1 -1.2,2.62; 5 1.2,2.62; 6 0,2.62 | smd 0.7 x 0.7: 2 1.3,-0.8; 4 -1.3,-0.8 | hole 0.9: 0,0
1X03_SERVO = drill 1.016 pad 1.88: 1 0,0; 2 2.54,0; 3 5.08,0
XBEE3_MICRO = smd 0.864 x 1.905: [RESERVED1] 0.681,-9.652; [RESERVED2] 1.93,-9.652; [RESERVED3] 3.18,-9.652; [RESERVED4] 4.43,-9.652; SPI_CLK/DIO18 -4.318,-9.652; SPI_MOSI/DIO15 -0.569,-9.652; SPI_MOSI/DIO16 -1.819,-9.652; SPI_SSEL/DIO17 -3.068,-9.652 | smd 1.905 x 0.864: [RESERVED5] 6.782,-6.65; AD0/DIO0 6.782,4.597; AD1/DIO1 6.782,3.348; AD2/DIO2 6.782,2.098; AD3/DIO3 6.782,0.848; ASSOCIATE/DIO5 6.782,-1.651; CTS/DIO7 6.782,-4.15; DIN/CONFIG/DIO14 -6.858,2.093; DIO4 6.782,-5.4; DIO12 -6.858,0.843; DOUT/DIO13 -6.858,3.343; DTR/SLEEP_RQ/DIO8 -6.858,-4.155; GND1 -6.858,5.842; GND2 -6.858,-5.405; GND3 -6.858,-7.904; GND4 6.782,-7.899; GND5 6.782,5.847; GND6 6.782,8.346; ON/SLEEP/DIO9 6.782,-2.901; PWM1/DIO11 -6.858,-2.906; RF 6.782,7.097; RSSI_PWM/DIO10 -6.858,-1.656; RST -6.858,-0.406; RTS/DIO6 6.782,-0.401; SPI_ATTN/BOOTMODE/DIO19 -6.858,-6.655; VCC -6.858,4.592
1X02_BATT = drill 1.016 pad 1.88: 1 0,0; 2 2.54,0
4UCONN_20329 = smd 1 x 2: BASE@1 -0.75,-2; BASE@2 0.75,-2 | smd 0.4 x 1.35: D+ 0,0.775; D- -0.65,0.775; GND 1.3,0.775; ID 0.65,0.775; VBUS -1.3,0.775 | drill 0.7 offset: SPRT@1 -3.3,0.9; SPRT@2 3.3,0.9 | drill 0.6 pad 2.413 square: SPRT@3 -3.6,-1.9; SPRT@4 3.6,-1.9 | hole 0.7: -1.95,0; 1.95,0
RESONATOR = smd 0.7 x 2: 1 -1,0; 2 0,0; 3 1,0

### Placement (x,y rotation side)
C1  7.11,7.75 90 top
C2  24.84,16.33 180 top
C3  20.45,13.08 0 top
C4  25.45,13.72 0 top
C5  21.84,13.08 90 top
C6  18.8,18.24 180 top
C7  22.17,7.62 90 top
C8  7.57,13.72 0 top
C9  35.56,13.41 180 top
C10  24.77,15.19 0 top
C11  14.43,4.7 180 top
C12  62.36,7.75 0 bottom
C13  62.36,6.22 0 bottom
C14  16.93,25.24 180 bottom
C15  23.6,25.38 270 bottom
C16  17.55,31.55 180 bottom
C17  21.99,23.63 180 bottom
C18  41.76,31.84 0 bottom
CHG  2.41,5.59 270 top
D5  9.73,12.19 90 top
IC1  18.62,5.97 0 top
IC2  29.21,13.46 180 top
J1  49.64,1.38 0 top
J3  25.31,32.97 180 top
JP4  25.4,1.27 180 top
JP5  30.48,21.59 0 top
PH1  61.7,29.43 270 bottom
PH2  35.67,30.63 0 bottom
PH3  3.53,30.99 270 bottom
Q1  11.68,17.78 0 top
Q3  14.05,12.45 0 top
R1  18.31,26.14 180 bottom
R2  45.43,30.21 270 bottom
R3  20.7,25 270 bottom
R4  22.4,25.42 90 bottom
R5  18.31,30.38 180 bottom
R6  54.35,27.54 270 bottom
R7  35.16,25.2 0 bottom
R8  10.82,31.35 270 bottom
R9  7.49,14.73 0 top
R101  22.71,12.06 270 top
R102  5.97,4.19 0 top
R104  14.48,8.94 0 top
R108  29.16,8.71 180 top
S1  6.35,24.13 180 top
U6  17.91,14.86 90 top
U7  17.91,11.23 90 top
U8  20.4,28.19 270 bottom
U9  13.79,27.99 90 bottom
U$1  47.97,32.67 0 top
U$2  57.28,17.14 90 bottom
U$46  47.97,30.24 0 top
U$47  42.42,29.65 270 bottom
U$56  4.54,18.72 180 top
X1  3.81,11.43 270 top
Y2  33.22,15.98 90 top

### Tracks (layer width: path | path; a pad name or v marks a point on that pad's centre or on a via)
3.3V  (via drill 0.35, 0.4)
  Top 0.203: R108.2 28.65,8.18 v29.21,7.62 | IC2.4 31.63,13.28 32,13.28 32.13,13.41 | 32.13,13.41 C9.2 v35.05,14.61 | v26.42,16.64 25.65,16.64 C2.1 25.35,15.27 C10.2 26.01,15.19 26.42,14.78 26.79,14.78 IC2.18 | IC2.6 31.63,14.14 32,14.14 32.22,13.93 32.22,13.5 32.13,13.41
  Top 0.406: U6.5 16.61,14.06 v15.33,15.33 | 25.27,15.11 C10.2 | C1.1 8,6.35 v8.89,6.35
  Bottom 0.203: C12.2 61.85,10.27 U$2.VCC | 61.58,31.13 PH1.1 61.7,29.41 | 59.69,33.02 59.69,31.75
  pour Bottom (isolate 0.305): 0,0 62.87,0 62.87,34.29 0,34.29
A0  (via drill 0.4, 0.8)
  Top 0.203: IC2.23 26.79,12.14 26.42,12.14 24.64,10.36 v24.64,9.27
  Route2 0.203: v24.64,9.27 16.64,1.27 JP4.12
  Route15 0.203: v44.45,12.7 31.8,12.7 29.97,10.87 29.97,6.73 28.42,5.18 26.13,5.18 24.01,7.31 24.01,7.93 24.64,8.57 v24.64,9.27
  Bottom 0.203: R6.2 54.61,27.03 | 54.61,27.03 54.97,27.03 v57.15,29.21 60.22,29.21 PH1.2 | 54.61,27.03 52.76,25.18 49.07,25.18 48.64,24.75 48.64,23.1 48.88,22.86 48.88,12.52 48.45,12.09 46.8,12.09 46.19,12.7 v44.45,12.7
A1  (via drill 0.4, 0.8)
  Top 0.203: v24.77,7.62 25.82,8.68 25.82,10.67 IC2.24
  Route2 0.203: v24.77,7.62 19.05,1.91 JP4.11
  Route15 0.203: v31.75,26.67 31.75,24.13 30.48,22.86 30.48,20.57 28.1,18.19 28.1,7.27 28.7,6.66 28.7,6.04 28.25,5.59 27.18,5.59 25.15,7.62 v24.77,7.62
  Bottom 0.203: PH2.2 31.75,28.41 v31.75,26.67 33.22,25.2 R7.2
A2  (via drill 0.4, 0.8)
  Top 0.203: IC2.25 26.23,9.88 v26.23,7.62
  Route2 0.203: JP4.10 23.72,3.4 23.72,4.58 26.23,7.08 v26.23,7.62
  Route15 0.203: v26.23,7.62 26.23,11.43 22.35,15.31 22.35,15.55 17.99,19.91 15.07,19.91 10.16,24.82 v10.16,27.94
  Bottom 0.203: PH3.2 8.81,29.29 v10.16,27.94 10.82,28.6 R8.2
A3  (via drill 0.4)
  Top 0.203: v27.34,7.62 27.69,7.97 27.69,9.26 27.96,9.53 IC2.26
  Route2 0.203: v27.34,7.62 24.13,4.41 JP4.9
  Route15 0.203: v27.34,7.62 26.63,8.32 26.63,11.85 18.16,20.32 15.24,20.32 13.97,21.59 13.97,26.67 17.78,30.48 20.32,30.48 22.77,32.93 J3.2
  Bottom 0.203: J3.2 22.77,30.21 U8.1 20.46,30.38 R5.2 18.05,31.14 C16.2
A4  (via drill 0.4)
  Top 0.203: IC2.27 28.46,9.45 28.1,9.09 28.1,7.66 28.46,7.3 28.46,6.87 v27.94,6.35
  Route2 0.203: v27.94,6.35 30.48,6.35 32.21,8.08 32.21,10.5 32.68,10.97 35.1,10.97 44.45,20.32 JP5.12
  Route15 0.203: JP5.12 v44.45,26.67
  Bottom 0.203: v44.45,26.67 43.18,27.94 41.88,27.94 U$47.4
AREF
  Top 0.203: C4.2 IC2.20
D0/RX  (via drill 0.4)
  Top 0.203: IC2.30 29.96,10.62 30.43,10.15 | 30.43,10.15 30.43,7.12 28.45,5.13 27.94,5.13 27.43,5.13 24.65,5.13 23.15,6.64 23.15,11.07 23.26,11.18 23.26,12.02 R101.1 | v33.15,8.51 31.5,10.15 31.44,10.15 31.34,10.05 30.58,10.05 30.48,10.15 30.43,10.15
  Route2 0.203: JP4.3 39.37,2.29 v33.15,8.51
D3  (via drill 0.4)
  Top 0.203: IC2.1 31.58,11.73 v33.02,11.73
  Route2 0.203: v33.02,11.73 26.67,18.08 JP5.5
  Route15 0.203: JP5.5 30.79,25.71 30.79,27.07 32.17,28.45 41.91,28.45 47.5,34.04 51.68,34.04 U$1.3
D4  (via drill 0.4)
  Top 0.203: JP5.4 25.78,19.94 v34.92,19.94 | IC2.2 31.63,12.28 32,12.28 32.45,12.73 34.03,12.73 35.33,11.43 36.83,11.43 38.1,12.7 38.1,14.73 v37.47,15.37
  Route2 0.203: v34.92,19.94 37.47,17.4 v37.47,15.37
  Route15 0.203: U$46.3 46.97,24.15 46.97,21.06 45.85,19.94 v34.92,19.94
D9  (via drill 0.4)
  Top 0.203: IC2.13 29.03,15.88 29.03,16.25 29.67,16.89 v30.86,16.89
  Route2 0.203: v30.86,16.89 30.86,18.16 JP5.8
  Route15 0.203: J1.3 54.72,1.89 v59.82,6.99 58.04,8.77 58.04,12.38 56.83,13.59 34.17,13.59 v30.86,16.89
  Bottom 0.203: U$2.DOUT/DIO13 60.62,7.79 v59.82,6.99
D10  (via drill 0.4)
  Top 0.203: v29.97,17.65 29.62,17.3 29.5,17.3 28.46,16.26 IC2.14
  Route2 0.203: v29.97,17.65 30.45,18.13 30.45,18.33 31.75,19.62 JP5.7
  Route15 0.203: v29.97,17.65 54.74,17.65 v59.69,12.7
  Bottom 0.203: J1.4 57.26,8.17 58.11,9.03 58.42,9.03 58.86,9.46 58.86,9.77 U$2.DIN/CONFIG/DIO14 59.37,12.38 v59.69,12.7
DTR
  Top 0.203: IC1.23 17.92,8.02 17.92,8.57 19.05,9.7 20.37,9.7 21.77,11.09 21.77,12.5 C5.1
GND  (via drill 0.35, 0.51, 0.8)
  Top 0.203: IC1.2 17.87,6.72 IC1.THERM 19.87,7.22 IC1.18 21.27,7.22 C7.2 | U7.2 19.56,11.23 | 6.99,8.13 C1.2
  Top 0.254: IC2.TH 29.46,13.46 29.71,13.71 IC2.5 | IC2.3 29.96,12.71 IC2.TH | IC2.TH 28.96,13.21 IC2.21 26.82,13.17 26.41,13.17 25.94,12.7 | R104.1 15.89,7.02 15.89,6.98 16.15,6.72 IC1.2 | X1.BASE@2 3.34,10.68 3.81,10.21 4.11,10.21 4.19,10.13 X1.GND
  Top 0.406: 5.34,8.13 6.99,8.13 | 25.94,12.7 25.58,13.06 25.54,13.06 24.94,13.66 C4.1
  Top 0.508: X1.GND 4.71,10.01 X1.SPRT@2
  Top 0.61: C11.2 13.56,5.05 11.94,5.05 11.91,5.08 v11.43,5.08 | v13.97,7.62 R104.1
  Route2 0.61: v11.43,5.08 v13.97,7.62
  Bottom 0.203: U$2.GND1 63.12,8 C12.1 C13.1 62.87,1.9 J1.6 | R8.1 13.86,31.86 v13.97,31.75 12.99,30.77 U9.2 | v38.1,25.4 37.9,25.2 R7.1 | R6.1 54.35,28.95 v57.15,31.75 | U$47.5 41.12,30.01 40.22,29.1 40.22,28.3 40.39,28.12 40.42,28.12 41.91,26.63 v41.91,25.4 | U9.2 15.12,29.29 U9.6 | U9.2 12.99,28.82 12.64,28.47 12.64,27.51 12.99,27.16 U9.4 | R4.1 23.56,24.91 C15.2 23.6,24.15 24.12,23.63 | C17.2 24.12,23.63 | 24.12,23.63 v24.13,23.62 | U8.2 22.07,27.82 22.6,27.82 24.16,26.27 24.16,25.51 24.12,25.48 24.12,23.63
  Bottom 0.254: C18.2 41.12,31.7 U$47.5
  pour Top (isolate 0.305): 62.87,34.29 62.87,0 0,0 0,34.29
N$1
  Bottom 0.203: U$47.3 44.43,28.7 R2.2
  Bottom 0.61: U$46.1 46.43,28.7 45.72,28.7 45.43,28.99 R2.2 46.34,30.36 46.34,31.03 U$1.1
N$2
  Top 0.203: IC1.3 16.56,6.27 14.17,6.27 9.01,11.43 X1.D+
N$3  (via drill 0.4)
  Top 0.203: X1.D- 4.73,12.22 7.36,12.22 7.48,12.34 v7.98,12.34 | v8,10.54 12.82,5.72 IC1.4
  Route2 0.203: v7.98,12.34 7.98,10.56 v8,10.54
N$16
  Bottom 0.203: U9.1 C14.1
N$17
  Bottom 0.203: R1.2 19.1,26.41 U8.4 17.8,28.54 R5.1 17.04,31.14 C16.1
N$18
  Top 0.203: CHG.C 4.06,5.59 R102.1
N$19  (via drill 0.4)
  Top 0.203: R102.2 4.83,2.54 v3.81,2.54
  Top 0.254: v17.79,11.3 18.18,11.3 18.28,11.21 18.28,10.81 18.47,10.62 18.86,10.62 U7.1
  Route2 0.203: v3.81,2.54 9.35,8.08 9.35,9.23 9.82,9.7 14.62,9.7 14.93,9.4 15.55,9.4 17.46,11.3 v17.79,11.3
N$20
  Top 0.203: U7.5 16.65,10.28 15.32,8.94
  Top 0.254: R104.2 15.32,8.94
N$23  (via drill 0.4)
  Top 0.203: 19.3,15.91 U6.3
  Top 0.406: 14.5,11.45 13.58,10.53 10.64,10.53 D5.K | Q3.2 15,10.4 v15.24,10.16 | U6.1 18.71,13.91 18.2,14.42 18.2,14.82 v17.85,15.17 18.07,15.17 18.44,15.54 18.94,15.54 U6.3 | C6.1 19.3,15.91
  Top 0.508: 14.5,11.45 Q3.2
  Route2 0.406: v15.24,10.16 15.24,13.97 16.51,15.24 16.58,15.17 v17.85,15.17
N$27
  Top 0.203: C11.1 14.96,4.72 IC1.6 IC1.5
N$29
  Bottom 0.203: C14.2 17.8,25.61 R1.1
N$30
  Bottom 0.203: R3.1 20.7,26.24 U8.3 | U8.3 21.7,26.63 R4.2 | U8.3 22.25,27.24 C15.1
N$41
  Top 0.203: IC1.16 21.28,6.22 C7.1
RESET  (via drill 0.4)
  Top 0.203: IC2.29 29.46,8.92 R108.1 30.02,8.36 30.02,7.28 28.28,5.54 24.94,5.54 23.55,6.93 23.55,10.9 23.67,11.01 23.67,12.54 22.62,13.59 C5.2 21.84,14.99 v21.59,15.24
  Route15 0.254: v21.59,15.24 19.21,15.24 11.83,7.86 11.83,6.48 11.37,6.02 11.1,6.02 JP4.16 7.62,2.54 44.45,2.54 JP4.1
RXD
  Top 0.203: R101.2 22.71,11.46 20.54,9.29 19.22,9.29 18.93,9.01 18.93,8.46 18.92,8.45 18.92,8.02 IC1.21
TX  (via drill 0.4)
  Top 0.203: IC2.31 30.53,11.04 30.53,10.67 30.75,10.46 31.18,10.46 31.83,11.11 32.07,11.11 v33.02,10.16 33.02,9.79 33.96,8.85 33.96,8.17 33.41,7.62 31.51,7.62 28.61,4.72 24.49,4.72 22.73,6.48 22.73,8.5 22.35,8.88 20.71,8.88 20.32,8.88 19.85,8.88 19.42,8.45 19.42,7.99 19.4,7.97 IC1.20
  Route2 0.203: v33.02,10.16 JP4.2
V_BATT
  Top 0.305: U7.3 19.22,12.19 C3.1
  Top 0.406: U7.3 17.94,13.45 17.59,13.45 17.38,13.23 15.84,13.23 15.62,13.45 Q3.3 14.05,15.37 Q1.2
  Top 0.61: S1.1 10.36,19.8 12.21,19.8 12.63,19.37 Q1.2
V_USB  (via drill 0.4, 0.51)
  Top 0.203: IC1.8 IC1.7 17.14,3.74 v15.24,3.74 | CHG.A 0.93,6.32 0.58,6.32 0.4,6.5 0.4,12.7 0.68,12.98 3.21,12.98 3.52,12.67 4.1,12.67 4.16,12.73 X1.VBUS
  Top 0.406: D5.A 11.22,11.45 Q3.1 14.01,12.36 15.48,12.36 15.67,12.18 U7.4 | v10.16,13.97 9.14,13.97 8.89,13.72 C8.2 7.72,13.36 7.72,13.3 7.15,12.73 X1.VBUS | v10.16,13.97 10.16,12.51 D5.A | D5.A 8.45,14.22 R9.2 | v10.16,13.97 10.73,14.54 Q1.1
  Route2 0.254: v10.16,13.97 10.16,10.65 3.03,3.52 3.03,2.21 3.48,1.76 4.13,1.76 6.12,3.74 v15.24,3.74
  Route2 0.406: v10.16,13.97 10.16,15.01 8.66,16.51 7.62,16.51 6.35,17.78 6.35,19.05 11.43,24.13 19.05,24.13 JP5.3
VCC_1  (via drill 0.4, 0.8)
  Top 0.61: Q1.3 9,18.78 v8.89,18.67
  Route2 0.61: v8.89,18.67 11.81,21.59 JP5.1
  Route15 0.61: JP5.1 27.94,33.02 v43.18,33.02
  Bottom 0.203: R2.1 45.31,30.6 U$47.1
  Bottom 0.61: v43.18,33.02 45.43,30.77 R2.1
VIN
  Top 0.61: U$56.1 5.56,18.72 6.35,19.52 S1.2
XB_DTR
  Bottom 0.203: U$2.DTR/SLEEP_RQ/DIO8 53.12,4.86 J1.1
XB_RTS  (via drill 0.4)
  Route2 0.203: J1.2 52.18,15.86 v57.28,20.95
  Bottom 0.203: v57.28,20.95 57.28,23.52 U$2.RTS/DIO6
XTAL1
  Top 0.254: IC2.8 31.56,16.06 31.56,16.45 32.09,16.98 Y2.3
XTAL2
  Top 0.203: IC2.7 31.63,14.78 31.75,14.78 32,14.78 32.19,14.98 33.02,14.98
  Top 0.254: 33.02,14.98 Y2.1

### Text on the board
tPlace: 3V3 / A3 / GND | GND / / __ / / 3V3 / / RX / / TX / / RST
bPlace: + | + | + | GND / / 3V3 / / DOUT / / DIN / / RTS / / DTR
bNames: GND / 3V3 / DIN / DOUT / RTS / DTR